# Altium schematic sheet MyProSch3.SchDoc: ESP32WROOM
size A
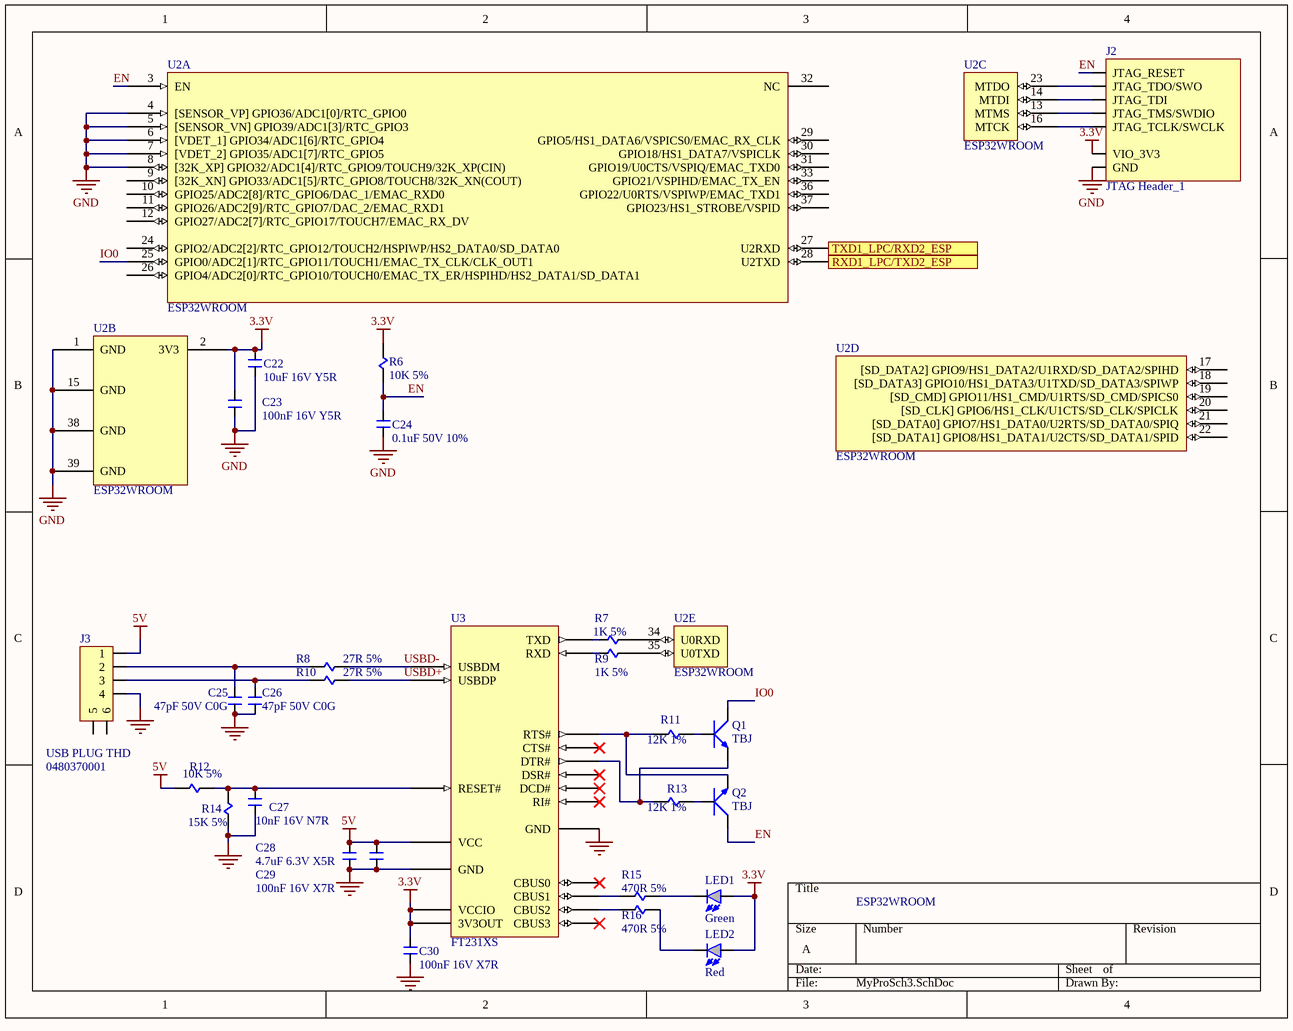
[diagram p0: MyProSch3.SchDoc]

## Parts
C22  10uF 16V Y5R  [C_0805]
C23  100nF 16V Y5R  [C_0805]
C24  0.1uF 50V 10%  [C_0805]
C25  47pF 50V C0G  [C_0805]
C26  47pF 50V C0G  [C_0805]
C27  10nF 16V N7R  [C_0805]
C28  4.7uF 6.3V X5R  [C_0805]
C29  100nF 16V X7R  [C_0805]
C30  100nF 16V X7R  [C_0805]
J2  JTAG Header_1  [HDRM_2.54mm_1X8]
J3  USB PLUG THD  Parameter 1: 0480370001  [USB_HDRM_A]
LED1  Green  [Led_0805]
LED2  Red  [Led_0805]
Q1  TBJ  [SOT-23]
Q2  TBJ  [SOT-23]
R6  10K 5%  [R_0805]
R7  1K 5%  [R_0805]
R8  27R 5%  [R_0805]
R9  1K 5%  [R_0805]
R10  27R 5%  [R_0805]
R11  12K 1%  [R_0805]
R12  10K 5%  [R_0805]
R13  12K 1%  [R_0805]
R14  15K 5%  [R_0805]
R15  470R 5%  [R_0805]
R16  470R 5%  [R_0805]
U2  ESP32WROOM  [ESP32_WROOM - duplicate]  (parts A,B,C,D,E of 5)
U3  FT231XS  [SSOP_20]

## Ports
RXD1_LPC/TXD2_ESP (out), TXD1_LPC/RXD2_ESP (in)

## Nets
3.3V: C22.1(A1) C23.1(A1) C30.1(A1) J2.1(VIO_3V3) LED1.1(A) LED2.1(A) R6.2(P2) U2.2(3V3) U3.3(VCCIO) U3.13(3V3OUT)
5V: C28.1(A1) C29.1(A1) J3.1 R12.1(P1) U3.15(VCC)
GND: C22.2(A2) C23.2(A2) C24.2(A2) C25.2(A2) C26.2(A2) C27.2(A2) C28.2(A2) C29.2(A2) C30.2(A2) J2.3(GND) J3.4 R14.2(P2) U2.1(GND) U2.4([SENSOR_VP]_GPIO36/ADC1[0]/RTC_GPIO0) U2.5([SENSOR_VN]_GPIO39/ADC1[3]/RTC_GPIO3) U2.6([VDET_1]_GPIO34/ADC1[6]/RTC_GPIO4) U2.7([VDET_2]_GPIO35/ADC1[7]/RTC_GPIO5) U2.8([32K_XP]_GPIO32/ADC1[4]/RTC_GPIO9/TOUCH9/32K_XP(CIN)) U2.15(GND) U2.38(GND) U2.39(GND) U3.6(GND) U3.16(GND)
EN: C24.1(A1) J2.4(JTAG_RESET) Q2.3(C) R6.1(P1) U2.3(EN)
IO0: Q1.3(C) U2.25(GPIO0/ADC2[1]/RTC_GPIO11/TOUCH1/EMAC_TX_CLK/CLK_OUT1)
RXD1_LPC/TXD2_ESP: U2.28(U2TXD) ; port RXD1_LPC/TXD2_ESP
TXD1_LPC/RXD2_ESP: U2.27(U2RXD) ; port TXD1_LPC/RXD2_ESP
USBD+: R10.2(P2) U3.11(USBDP)
USBD-: R8.2(P2) U3.12(USBDM)
NetC25_1: C25.1(A1) J3.2 R8.1(P1)
NetC26_1: C26.1(A1) J3.3 R10.1(P1)
NetC27_1: C27.1(A1) R12.2(P2) R14.1(P1) U3.14(RESET#)
NetJ2_5: J2.5(JTAG_TMS/SWDIO) U2.13(MTMS)
NetJ2_6: J2.6(JTAG_TDI) U2.14(MTDI)
NetJ2_7: J2.7(JTAG_TCLK/SWCLK) U2.16(MTCK)
NetJ2_8: J2.8(JTAG_TDO/SWO) U2.23(MTDO)
NetLED1_2: LED1.2(K) R15.2(P2)
NetLED2_2: LED2.2(K) R16.2(P2)
NetQ1_1: Q1.1(B) R11.2(P2)
NetQ1_2: Q1.2(E) R13.1(P1) U3.1(DTR#)
NetQ2_1: Q2.1(B) R13.2(P2)
NetQ2_2: Q2.2(E) R11.1(P1) U3.2(RTS#)
NetR7_1: R7.1(P1) U3.20(TXD)
NetR7_2: R7.2(P2) U2.34(U0RXD)
NetR9_1: R9.1(P1) U3.4(RXD)
NetR9_2: R9.2(P2) U2.35(U0TXD)
NetR15_1: R15.1(P1) U3.17(CBUS1)
NetR16_1: R16.1(P1) U3.10(CBUS2)

Not connected (* = marked no-connect by the designer): J3 5 6; U2 9([32K_XN]_GPIO33/ADC1[5]/RTC_GPIO8/TOUCH8/32K_XN(COUT)) 10(GPIO25/ADC2[8]/RTC_GPIO6/DAC_1/EMAC_RXD0) 11(GPIO26/ADC2[9]/RTC_GPIO7/DAC_2/EMAC_RXD1) 12(GPIO27/ADC2[7]/RTC_GPIO17/TOUCH7/EMAC_RX_DV) 17([SD_DATA2]_GPIO9/HS1_DATA2/U1RXD/SD_DATA2/SPIHD) 18([SD_DATA3]_GPIO10/HS1_DATA3/U1TXD/SD_DATA3/SPIWP) 19([SD_CMD]_GPIO11/HS1_CMD/U1RTS/SD_CMD/SPICS0) 20([SD_CLK]_GPIO6/HS1_CLK/U1CTS/SD_CLK/SPICLK) 21([SD_DATA0]_GPIO7/HS1_DATA0/U2RTS/SD_DATA0/SPIQ) 22([SD_DATA1]_GPIO8/HS1_DATA1/U2CTS/SD_DATA1/SPID) 24(GPIO2/ADC2[2]/RTC_GPIO12/TOUCH2/HSPIWP/HS2_DATA0/SD_DATA0) 26(GPIO4/ADC2[0]/RTC_GPIO10/TOUCH0/EMAC_TX_ER/HSPIHD/HS2_DATA1/SD_DATA1) 29(GPIO5/HS1_DATA6/VSPICS0/EMAC_RX_CLK) 30(GPIO18/HS1_DATA7/VSPICLK) 31(GPIO19/U0CTS/VSPIQ/EMAC_TXD0) 32(NC) 33(GPIO21/VSPIHD/EMAC_TX_EN) 36(GPIO22/U0RTS/VSPIWP/EMAC_TXD1) 37(GPIO23/HS1_STROBE/VSPID); U3 5(RI#)* 7(DSR#)* 8(DCD#)* 9(CTS#)* 18(CBUS0)* 19(CBUS3)*

## Library data of the parts
C22-C30 = Capacitor
J3 = Connectorx6
LED1 = Led_G: Green LED
LED2 = Led_R: Red LED
Q1 Q2 = TBJ_NPN
R6-R16 = Resistor